# Altium project 超声波车位检测.PRJPCB
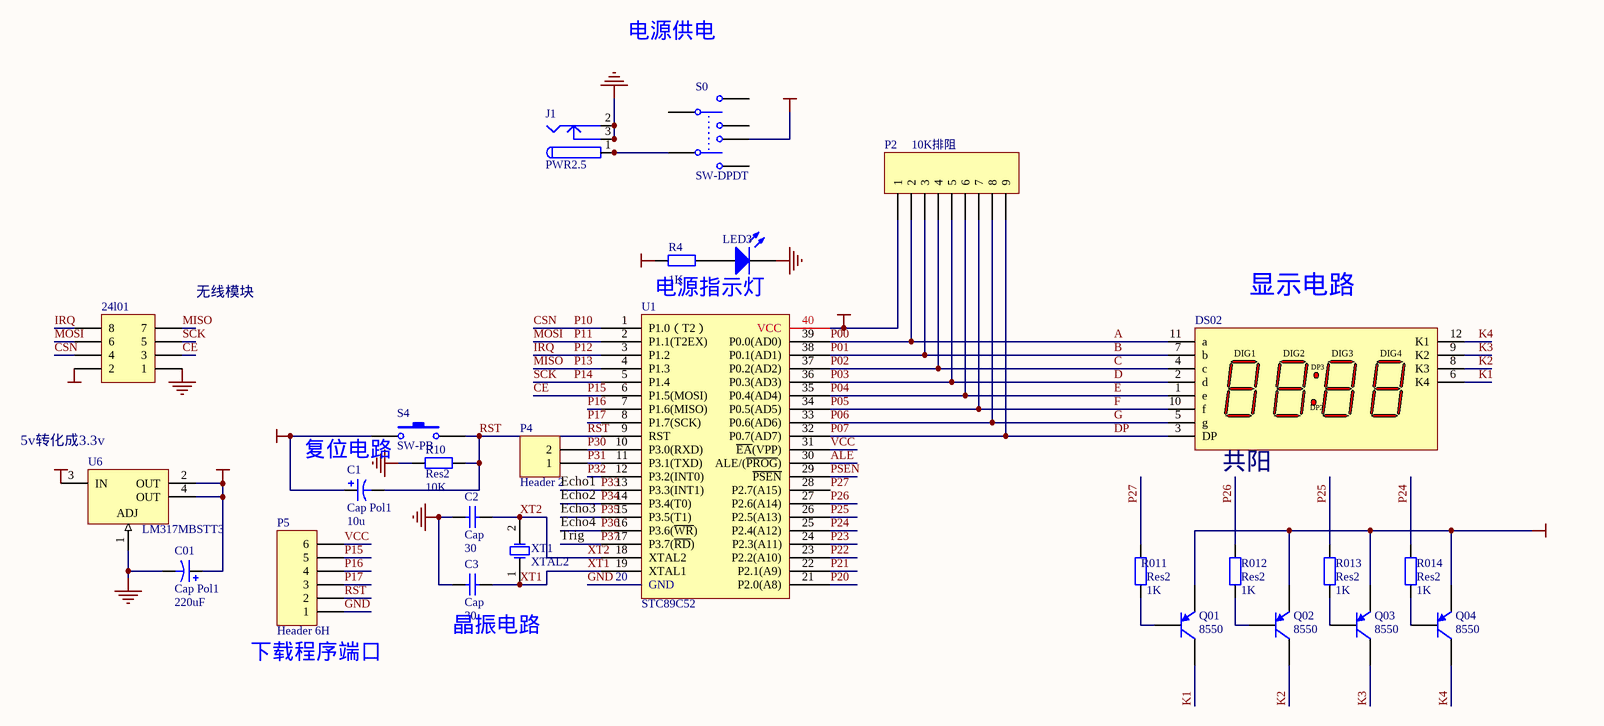
[diagram p0: 超声波车位检测.SCHDOC]
1 sheet, 26 parts. Net scope: global (net labels, ports and power ports of the same name join across sheets).
Board file: 超声波车位检测.PCBDOC

## Sheet 超声波车位检测.SCHDOC
size A3

### Parts
24l01  Header 4X2  [HDR2X4]  (value not drawn)
C1  Cap Pol1  value 10u  [电容]
C01  Cap Pol1  value 220uF  [电容]
C2  Cap  value 30  [RAD-0.1]
C3  Cap  value 30  [RAD-0.1]
DS02  共阳  [4位带4点大数码管]
J1  PWR2.5  [KLD-0202]
LED3  LED0  [LED-1]  (value not drawn)
P2  10K排阻  [HDR1X9]
P4  Header 2  [HDR1X2]
P5  Header 6H  [HDR1X6]
Q01  8550  [BCY-W3/E4]
Q02  8550  [BCY-W3/E4]
Q03  8550  [BCY-W3/E4]
Q04  8550  [BCY-W3/E4]
R4  value 1K  [AXIAL-0.4]  (hidden comment: Res2)
R10  Res2  value 10K  [AXIAL-0.4]
R011  Res2  value 1K  [AXIAL-0.4]
R012  Res2  value 1K  [AXIAL-0.4]
R013  Res2  value 1K  [AXIAL-0.4]
R014  Res2  value 1K  [AXIAL-0.4]
S0  SW-DPDT  [DPDT-6]
S4  SW-PB  [点动按键]
U1  STC89C52  [AT89S52]
U6  LM317MBSTT3  [318E-04]
XT1  XTAL2  [圆晶振]

### Nets
3.3V: 24l01.2 C01.1 U6.2(OUT) U6.4(OUT)
GND: 24l01.1 C01.2 C2.1 C3.1 J1.2 J1.2A J1.2B J1.3 J1.3A J1.3B LED3.2(K) P5.1 R10.1 U1.20(GND) U6.1(ADJ)
VCC: C1.1 P2.1 P5.6 Q01.1(E) Q02.1(E) Q03.1(E) Q04.1(E) R4.1 S0.5 S4.1 U1.31(~{EA}(VPP)) U1.40(VCC) U6.3(IN)
A: DS02.11(a) P2.2 U1.39(P0.0(AD0))  [also labelled P00]
ALE: U1.30(ALE/(~{PROG}))
B: DS02.7(b) P2.3 U1.38(P0.1(AD1))  [also labelled P01]
C: DS02.4(c) P2.4 U1.37(P0.2(AD2))  [also labelled P02]
CE: 24l01.3 P5.5 U1.6(P1.5(MOSI))  [also labelled P15]
CSN: 24l01.4 U1.1(P1.0（T2）)  [also labelled P10]
D: DS02.2(d) P2.5 U1.36(P0.3(AD3))  [also labelled P03]
DP: DS02.3(DP) P2.9 U1.32(P0.7(AD7))  [also labelled P07]
E: DS02.1(e) P2.6 U1.35(P0.4(AD4))  [also labelled P04]
Echo1: U1.13(P3.3(INT1))  [also labelled P33]
Echo2: U1.14(P3.4(T0))  [also labelled P34]
Echo3: U1.15(P3.5(T1))  [also labelled P35]
Echo4: U1.16(P3.6(~{WR}))  [also labelled P36]
F: DS02.10(f) P2.7 U1.34(P0.5(AD5))  [also labelled P05]
G: DS02.5(g) P2.8 U1.33(P0.6(AD6))  [also labelled P06]
IRQ: 24l01.8 U1.3(P1.2)  [also labelled P12]
K1: DS02.6(K4) Q01.3(C)
K2: DS02.8(K3) Q02.3(C)
K3: DS02.9(K2) Q03.3(C)
K4: DS02.12(K1) Q04.3(C)
MISO: 24l01.7 U1.4(P1.3)  [also labelled P13]
MOSI: 24l01.6 U1.2(P1.1(T2EX))  [also labelled P11]
P14: 24l01.5 U1.5(P1.4)  [also labelled SCK]
P16: P5.4 U1.7(P1.6(MISO))
P17: P5.3 U1.8(P1.7(SCK))
P20: U1.21(P2.0(A8))
P21: U1.22(P2.1(A9))
P22: U1.23(P2.2(A10))
P23: U1.24(P2.3(A11))
P24: R014.1 U1.25(P2.4(A12))
P25: R013.1 U1.26(P2.5(A13))
P26: R012.1 U1.27(P2.6(A14))
P27: R011.1 U1.28(P2.7(A15))
P30: P4.2 U1.10(P3.0(RXD))
P31: P4.1 U1.11(P3.1(TXD))
P32: U1.12(P3.2(INT0))
P37: U1.17(P3.7(~{RD}))  [also labelled Trig]
PSEN: U1.29(~{PSEN})
RST: C1.2 P5.2 R10.2 S4.2 U1.9(RST)
XT1: C3.2 U1.19(XTAL1) XT1.1(OSC1)
XT2: C2.2 U1.18(XTAL2) XT1.2(OSC2)
NetJ1_1: J1.1 J1.1A J1.1B S0.4
NetLED3_1: LED3.1(A) R4.2
NetQ01_2: Q01.2(B) R011.2
NetQ02_2: Q02.2(B) R012.2
NetQ03_2: Q03.2(B) R013.2
NetQ04_2: Q04.2(B) R014.2

Not connected (* = marked no-connect by the designer): S0 1 2 3 6

### Notes on the sheet
- 电源供电
- (near 24l01) 无线模块
- 电源指示灯
- (near DS02) 显示电路
- (near U6) 5v转化成3.3v
- (near C1) 复位电路
- (near C3) 晶振电路
- (near P5) 下载程序端口
- (in symbol HDSP-B03E) DIG1; DIG2; DIG3; DIG4; DP3; DP2

### Library data of the parts
24l01 = Header 4X2: Header, 4-Pin, Dual row; LatestRevisionDate: 17-Jul-2002; LatestRevisionNote: Re-released for DXP Platform.; Publisher: Altium Limited
C1 C01 = Cap Pol1: Polarized Capacitor (Radial); Published: 8-Jun-2000; LatestRevisionDate: 17-Jul-2002; LatestRevisionNote: Re-released for DXP Platform.; Publisher: Altium Limited
C2 C3 = Cap: Capacitor; Published: 8-Jun-2000; LatestRevisionDate: 17-Jul-2002; LatestRevisionNote: Re-released for DXP Platform.; Publisher: Altium Limited
DS02 = HDSP-B03E: 14.22 mm GaP HER, Untinted, 88:88 4-Digit 7-Segment Display: CC, Gray Surface; LuminousIntensity: 3200 ucd (Minimum).; LED_Colour: High Efficiency Red (HER); Published: 26-May-2004; LatestRevisionDate: 11-Oct-2004; LatestRevisionNote: Display outline superimposed on PCB Footprint.; DatasheetDocument: 21-Aug-2001; PackageDocument: 20-Nov-2001; PackageReference: B-88; Publisher: Altium Limited
J1 = PWR2.5: Low Voltage Power Supply Connector; Published: 17-Dec-2003; DatasheetDocument: 09-May-2002; Publisher: Altium Limited
LED3 = LED0: Typical INFRARED GaAs LED; Published: 8-Jun-2000; LatestRevisionDate: 17-Jul-2002; LatestRevisionNote: Re-released for DXP Platform.; Publisher: Altium Limited
P2 = Header 9: Header, 9-Pin; LatestRevisionDate: 17-Jul-2002; LatestRevisionNote: Re-released for DXP Platform.; Publisher: Altium Limited
P4 = Header 2: Header, 2-Pin; LatestRevisionDate: 17-Jul-2002; LatestRevisionNote: Re-released for DXP Platform.; Publisher: Altium Limited
P5 = Header 6H: Header, 6-Pin, Right Angle; LatestRevisionDate: 17-Jul-2002; LatestRevisionNote: Re-released for DXP Platform.; Publisher: Altium Limited
Q01 Q02 Q03 Q04 = 2N3906: PNP General Purpose Amplifier; Published: 8-Jun-2000; LatestRevisionDate: 15-Jan-2003; LatestRevisionNote: PCB Footprint 'BCY-W3/D4.7' replaced; DatasheetDocument: 1997; PackageReference: TO-92A; Publisher: Altium Limited; Code_JEDEC: TO-92A
R4 R10 R011 R012 R013 R014 = Res2: Resistor; Published: 8-Jun-2000; LatestRevisionDate: 17-Jul-2002; LatestRevisionNote: Re-released for DXP Platform.; Publisher: Altium Limited
S0 = SW-DPDT: Double-Pole, Double-Throw Switch; Published: 24-Mar-1999; LatestRevisionDate: 17-Jul-2002; LatestRevisionNote: Re-released for DXP Platform.; Publisher: Altium Limited
S4 = SW-PB: Switch; Published: 24-Mar-1999; LatestRevisionDate: 17-Jul-2002; LatestRevisionNote: Re-released for DXP Platform.; Publisher: Altium Limited
U1 = AT89S52
U6 = LM317MBSTT3: Three-Terminal Adjustable Output Positive Voltage Regulator; Note: Pin 2 is electrically connected to Pin 4 (TAB); Published: 15-Apr-2002; DatasheetVersion: Nov-1999; PackageVersion: Nov-1999; PackageReference: 318E-04; Publisher: Altium Limited; PackageDescription: SOT-223/SC-73; 4 Leads; Body 6.7 x 7.3 mm, inc. leads (LxW max); ComponentLink1Description: Manufacturer Link; ComponentLink1URL: http://www.onsemi.com/site/products/taxonomy/0,4438,503,00.html; ComponentLink2Description: Datasheet; ComponentLink2URL: http://www.onsemi.com/pub/Collateral/LM317M-D.PDF